# Altium schematic sheet FT62F131_DEMO.SchDoc
size A4
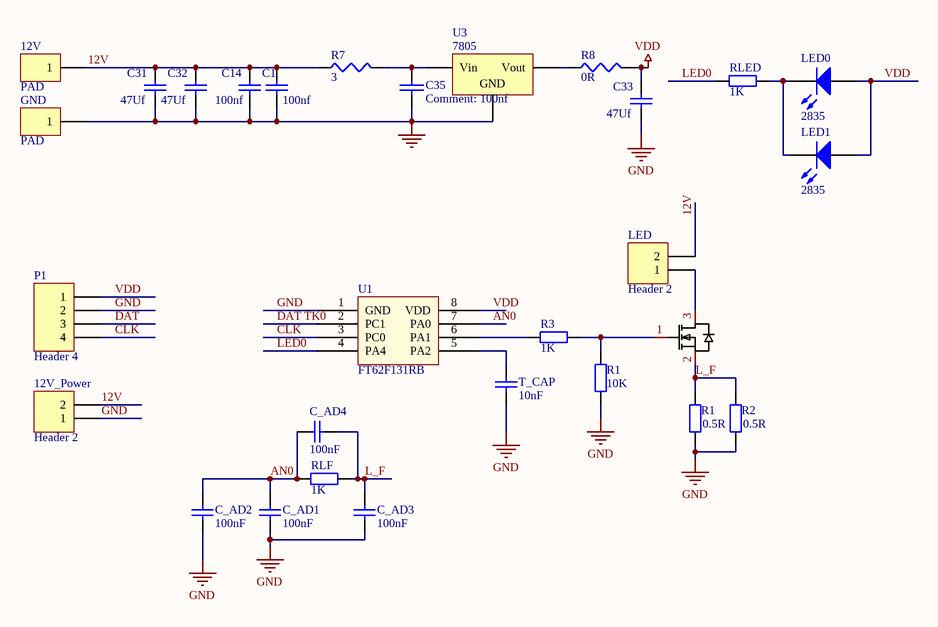
[diagram p0: FT62F131_DEMO.SchDoc]

## Parts
(Parts that share a designator on the sheet are numbered #1, #2 ... from top to bottom, then left to right.)
12V  PAD  [PAD_12V]
12V_Power  Header 2  [XH-2AW]
C1  100nf  [C0805]
C14  100nf  [C0805]
C31  47Uf  [C0805]
C32  47Uf  [C0805]
C33  47Uf  [C0805]
C35  100nf  [C0805]
C_AD1  100nF  [C0805]
C_AD2  100nF  [C0805]
C_AD3  100nF  [C0805]
C_AD4  100nF  [C0805]
GND  PAD  [PAD_12V]
LED  Header 2  [XH-2AW]
LED0  2835  [2835-LED]
LED1  2835  [2835-LED]
P1  Header 4  [Debug]
Q1  SI2310  [SOT-23_L2.9-W1.3-P1.90-LS2.4-BR]  (value not drawn)
R1#1  10K  [R0805]
R1#2  0.5R  [R1206]
R2  0.5R  [R1206]
R3  1K  [R0805]
R7  3  [R0805]
R8  0R  [R0805]
RLED  1K  [R0805]
RLF  1K  [R0805]
T_CAP  10nF  [C0805]
U1  FT62F131RB  [SO8_L]
U3  7805  [SOT89-3]

## Nets
GND: 12V_Power.1 C1.2 C14.2 C31.2 C32.2 C33.2 C35.1 C_AD1.1 C_AD2.1 C_AD3.1 GND.1 P1.2 R1#1.1 R1#2.1 R2.1 T_CAP.1 U1.1(GND) U3.2(GND)
VDD: C33.1 LED0.1(A) LED1.1(A) P1.1 R8.2 U1.8(VDD)
12V: 12V.1 12V_Power.2 C1.1 C14.1 C31.1 C32.1 LED.2 R7.1
AN0: C_AD1.2 C_AD2.2 C_AD4.2 RLF.2 U1.7(PA0)
CLK: P1.4 U1.3(PC0)
DAT: P1.3 U1.2(PC1)  [also labelled TK0]
L_F: C_AD3.2 C_AD4.1 Q1.2(S) R1#2.2 R2.2 RLF.1
LED0: RLED.2 U1.4(PA4)
NetC35_2: C35.2 R7.2 U3.3(Vin)
NetLED0_2: LED0.2(K) LED1.2(K) RLED.1
NetLED_1: LED.1 Q1.3(D)
NetQ1_1: Q1.1(G) R1#1.2 R3.1
NetR3_2: R3.2 U1.6(PA1)
NetR8_1: R8.1 U3.1(Vout)
NetT_CAP_2: T_CAP.2 U1.5(PA2)

## Library data of the parts
12V GND = PAD: NPN General Purpose Amplifier; Published: *; LatestRevisionDate: *; LatestRevisionNote: *; DatasheetDocument: *; PackageDocument: *; PackageReference: *; Publisher: *; Code_JEDEC: *; ComponentLink1Description: *; ComponentLink1URL: *; ComponentLink2Description: *; ComponentLink2URL: *
12V_Power LED = Header 2: Header, 2-Pin; LatestRevisionDate: 17-Jul-2002; LatestRevisionNote: Re-released for DXP Platform.; Publisher: Altium Limited
C1 C14 C31-C33 = Cap: Capacitor; Published: *; LatestRevisionDate: *; LatestRevisionNote: *; PackageReference: *; Publisher: *; Value: *
C35 = CAP: Capacitor
C_AD1-C_AD4 T_CAP = Cap Semi: Capacitor (Semiconductor SIM Model); Value: 100pF; Published: 8-Jun-2000; LatestRevisionDate: 29-May-2009; LatestRevisionNote: IPC-7351 Footprint Added.; PackageReference: C1206; Publisher: Altium Limited; PackageDescription: Chip Capacitor
LED0 LED1 = LED0: Typical INFRARED GaAs LED; Published: *; LatestRevisionDate: *; LatestRevisionNote: *; PackageReference: *; Publisher: *
P1 = Header 4: Header, 4-Pin; LatestRevisionDate: 17-Jul-2002; LatestRevisionNote: Re-released for DXP Platform.; Publisher: Altium Limited
Q1 = SI2310: Symbol: SI2310_C2938374; Add into BOM: yes; Drain Source Voltage (Vdss): 60V; Continuous Drain Current (Id): 3A; Power Dissipation (Pd): 1.5W; Gate Threshold Voltage (Vgs(th)@Id): 2V@250uA; Total Gate Charge (Qg@Vgs): 6nC@4.5V; Input Capacitance (Ciss@Vds): 247pF@30V; Reverse Transfer Capacitance (Crss@Vds): 19.5pF@30V; Name: SI2310; Device: SI2310; Supplier Part: C2938374; Manufacturer Part: SI2310; Supplier Footprint: SOT23; JLCPCB Part Class: Extended Part; Datasheet: https://atta.szlcsc.com/upload/public/pdf/source/20211229/B6B9B926720553F4D66DA74BE29399F0.pdf; Supplier: LCSC; Convert to PCB: yes
R1#1 R1#2 R2 = Res2: Resistor; Value: 1K; Published: 8-Jun-2000; LatestRevisionDate: 17-Jul-2002; LatestRevisionNote: Re-released for DXP Platform.; PackageReference: AXIAL-0.4; Publisher: Altium Limited; PackageDescription: Axial Device, Thru-Hole; 2 Leads; 0.4 in Pin Spacing
R3 RLED RLF = Res2: Resistor; Published: 8-Jun-2000; LatestRevisionDate: 17-Jul-2002; LatestRevisionNote: Re-released for DXP Platform.; PackageReference: AXIAL-0.4; Publisher: Altium Limited; PackageDescription: Axial Device, Thru-Hole; 2 Leads; 0.4 in Pin Spacing; Value: 1K
R7 R8 = RES1
U3 = Volt Reg: Voltage Regulator; Published: *; LatestRevisionDate: *; LatestRevisionNote: *; PackageReference: *; Publisher: *; Code_JEDEC: *